# Altium schematic sheet C_conn_1P25D.SchDoc
size A; SheetNumber: 11; SheetTotal: 17
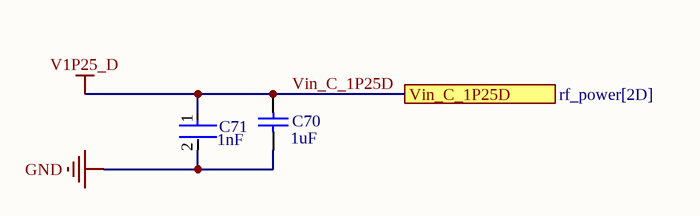
[diagram p0: C_conn_1P25D.SchDoc]

## Parts
C70  value 1uF  [CAPC2013X145X50LL20T25]  (hidden comment: C0805C105K4PACTU)
C71  Capacitance: 1nF  [FP-0805-L_2_01_0_2-W_1_25-IPC_C]  (hidden comment: 08055C102KAT2A)

## Ports
Vin_C_1P25D (see rf_power[2D])

## Nets
GND: C70.1 C71.2
Vin_C_1P25D: C70.2 C71.1 ; port Vin_C_1P25D  [also labelled V1P25_D]

## Library data of the parts
C70 = CMP-1036-04746-2: Manufacturer: Kemet; Part Number: C0805C105K4PACTU
C71 = CMP-1036-02979-3: General Purpose Ceramic Capacitor, 0805, 1nF, 10%, X7R, 0.15, 50V; Dissipation Factor: 2.5%; Insulation Resistance: 100GR; Radiation Hardening: No; Case Code (Imperial): 0805; Packaging: Tape and Reel; Height: 0.94mm; Number of Pins: 2; REACH SVHC: No SVHC; Case Code (Metric): 2012; Voltage: 50V; Max Operating Temperature: 125°C; Tolerance: 10%; Voltage Rating: 50V; Depth: 1.25mm; Voltage Rating (DC): 50V; Thickness: 0.037inch; Termination: SMD/SMT; Package Quantity: 1; RoHS Compliant: Yes; Mount: Surface Mount; Dielectric: X7R; Length: 2.01mm; Contact Plating: Tin; Lead Free: Lead Free; Case/Package: 0805; Width: 1.25mm; Dielectric Material: Ceramic; Min Operating Temperature: -55°C